# EAGLE design tester (EAGLE 9.6.2)
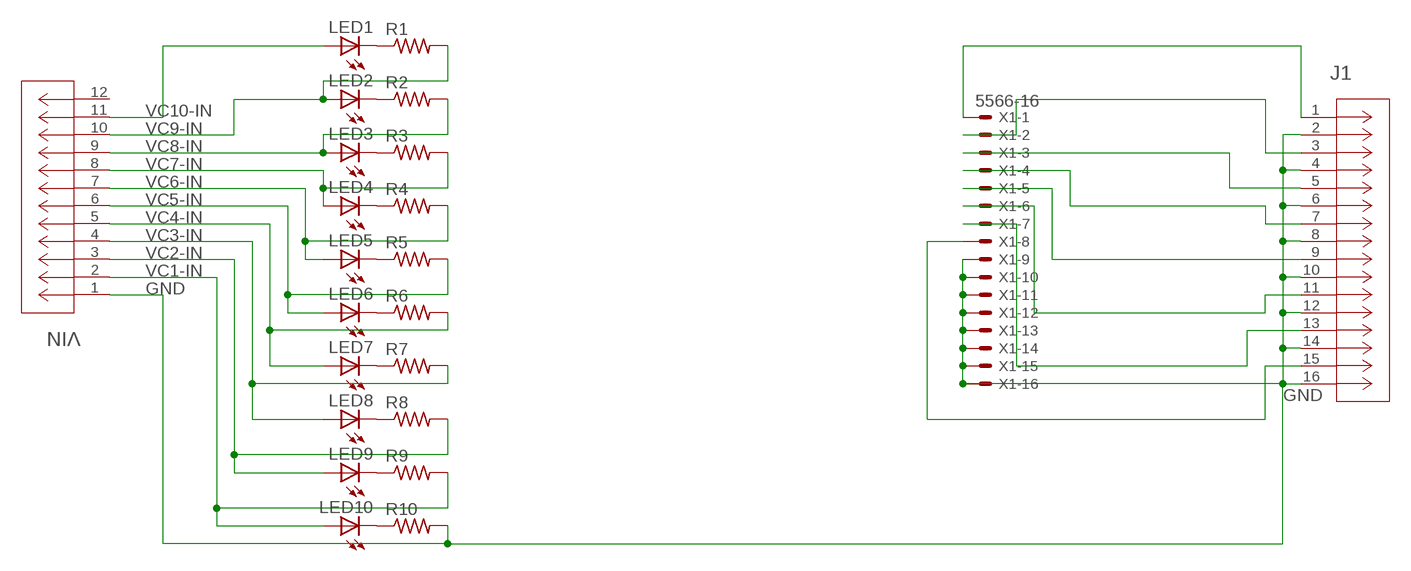
[diagram p0: schematic, sheet 1]

## Parts
J1  DF11-16DP-2DSA(01)  [CONN_DF11-16DP-2DSA(01)_HIR]
LED1  LEDCHIPLED_0603  [CHIPLED_0603]
LED2  LEDCHIPLED_0603  [CHIPLED_0603]
LED3  LEDCHIPLED_0603  [CHIPLED_0603]
LED4  LEDCHIPLED_0603  [CHIPLED_0603]
LED5  LEDCHIPLED_0603  [CHIPLED_0603]
LED6  LEDCHIPLED_0603  [CHIPLED_0603]
LED7  LEDCHIPLED_0603  [CHIPLED_0603]
LED8  LEDCHIPLED_0603  [CHIPLED_0603]
LED9  LEDCHIPLED_0603  [CHIPLED_0603]
LED10  LEDCHIPLED_0603  [CHIPLED_0603]
R1  R-US_R0805  [R0805]
R2  R-US_R0805  [R0805]
R3  R-US_R0805  [R0805]
R4  R-US_R0805  [R0805]
R5  R-US_R0805  [R0805]
R6  R-US_R0805  [R0805]
R7  R-US_R0805  [R0805]
R8  R-US_R0805  [R0805]
R9  R-US_R0805  [R0805]
R10  R-US_R0805  [R0805]
VIN  DF11-12DP-2DSA(01)  [CON12_2X6_UF_DF11_HIR]
X1  5566-16  [5566-16]

## Nets
GND: J1.2 J1.4 J1.6 J1.8 J1.10 J1.12 J1.14 J1.16 R10.2 VIN.1 X1.9 X1.10 X1.11 X1.12 X1.13 X1.14 X1.15 X1.16
N$1: LED2.C R2.1
N$2: LED3.C R3.1
N$3: LED5.C R5.1
N$4: LED6.C R6.1
N$5: LED7.C R7.1
N$6: LED8.C R8.1
N$7: LED9.C R9.1
N$8: LED10.C R10.1
N$9: LED1.C R1.1
N$10: LED4.C R4.1
TEMP1: J1.1 X1.1
TEMP2: J1.3 X1.2
TEMP3: J1.5 X1.3
TEMP4: J1.7 X1.4
TEMP5: J1.9 X1.5
TEMP6: J1.11 X1.6
TEMP7: J1.13 X1.7
TEMP8: J1.15 X1.8
VC1-IN: LED10.A R9.2 VIN.2
VC2-IN: LED9.A R8.2 VIN.3
VC3-IN: LED8.A R7.2 VIN.4
VC4-IN: LED7.A R6.2 VIN.5
VC5-IN: LED6.A R5.2 VIN.6
VC6-IN: LED5.A R4.2 VIN.7
VC7-IN: LED4.A R3.2 VIN.8
VC8-IN: LED3.A R2.2 VIN.9
VC9-IN: LED2.A R1.2 VIN.10
VC10-IN: LED1.A VIN.11
Unconnected: VIN.12

## Library data of the parts
J1 = hirose_connectors:DF11-16DP-2DSA(01); COPYRIGHT: Copyright (C) 2023 Ultra Librarian. All rights reserved.; MANUFACTURER_PART_NUMBER: DF11-16DP-2DSA(01); MFR_NAME: Hirose
LED1-LED10 = adafruit:LED: LED OSRAM: - CHIPLED LG R971, LG N971, LY N971, LG Q971, LY Q971, LO R971, LY R971 LH N974, LH R974 LS Q976, LO Q976, LY Q976 LO Q996 - Hyper CHIPLED LW Q18S LB Q993, LB Q99A, LB R99A - SideLED LS A670, LO A670, LY A670, LG A670, LP A670 LB A673, LV A673, LT A673, LW A673 LH A674 LY A675 LS A676, LA A676, LO A676, LY A676, LW A676 LS A679, LY A679, LG A679 - Hyper Micro SIDELED® LS Y876, LA Y876, LO Y876, LY Y876 LT Y87S - SmartLED LW L88C, LW L88S LB L89C, LB L89S, LG L890 LS L89K, LO L89K, LY L89K LS L896, LA L896, LO L896, LY L896 - TOPLED LS T670, LO T670, LY T670, LG T670, LP T670 LSG T670, LSP T670, LSY T670, LOP T670, LYG T670 LG T671, LOG T671, LSG T671 LB T673, LV T673, LT T673, LW T673 LH T674 LS T676, LA T676, LO T676, LY T676, LB T676, LH T676, LSB T676, LW T676 LB T67C, LV T67C, LT T67C, LS T67K, LO T67K, LY T67K, LW E67C LS E67B, LA E67B, LO E67B, LY E67B, LB E67C, LV E67C, LT E67C LW T67C LS T679, LY T679, LG T679 LS T770, LO T770, LY T770, LG T770, LP T770 LB T773, LV T773, LT T773, LW T773 LH T774 LS E675, LA E675, LY E675, LS T675 LS T776, LA T776, LO T776, LY T776, LB T776 LHGB T686 LT T68C, LB T68C - Hyper Mini TOPLED® LB M676 - Mini TOPLED Santana® LG M470 LS M47K, LO M47K, LY M47K Source: http://www.osram.convergy.de/
R1-R10 = rcl:R-US_: RESISTOR, American symbol; SPICEPREFIX: R
VIN = hirose_connectors:DF11-12DP-2DSA(01); COPYRIGHT: Copyright (C) 2023 Ultra Librarian. All rights reserved.; MANUFACTURER_PART_NUMBER: DF11-12DP-2DSA(01); MFR_NAME: Hirose
X1 = con-molex:5566-16: Mini FIT connector 16 pol Source: http://www.molex.com; MF: MOLEX; OC_FARNELL: unknown; OC_NEWARK: unknown

## Board
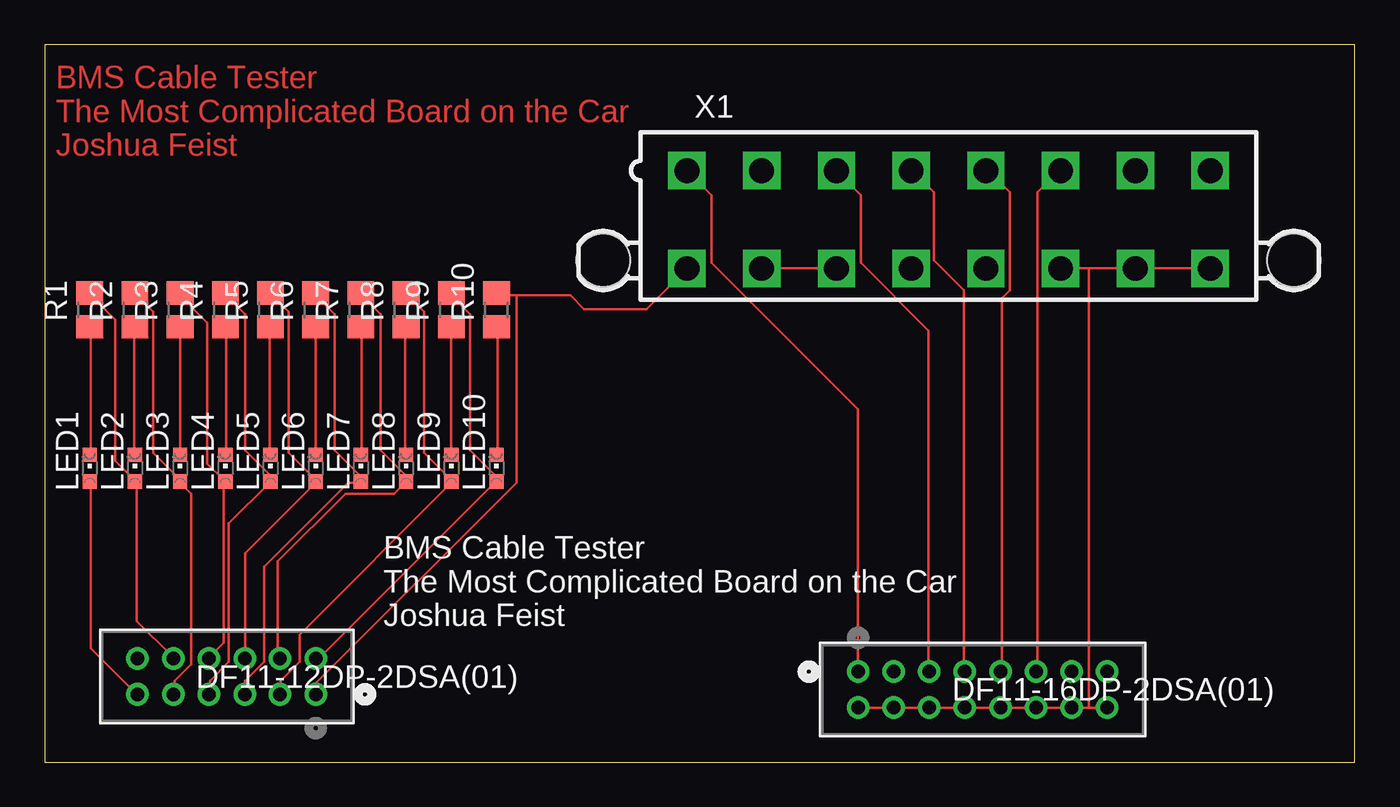
[diagram p1: board, top side]
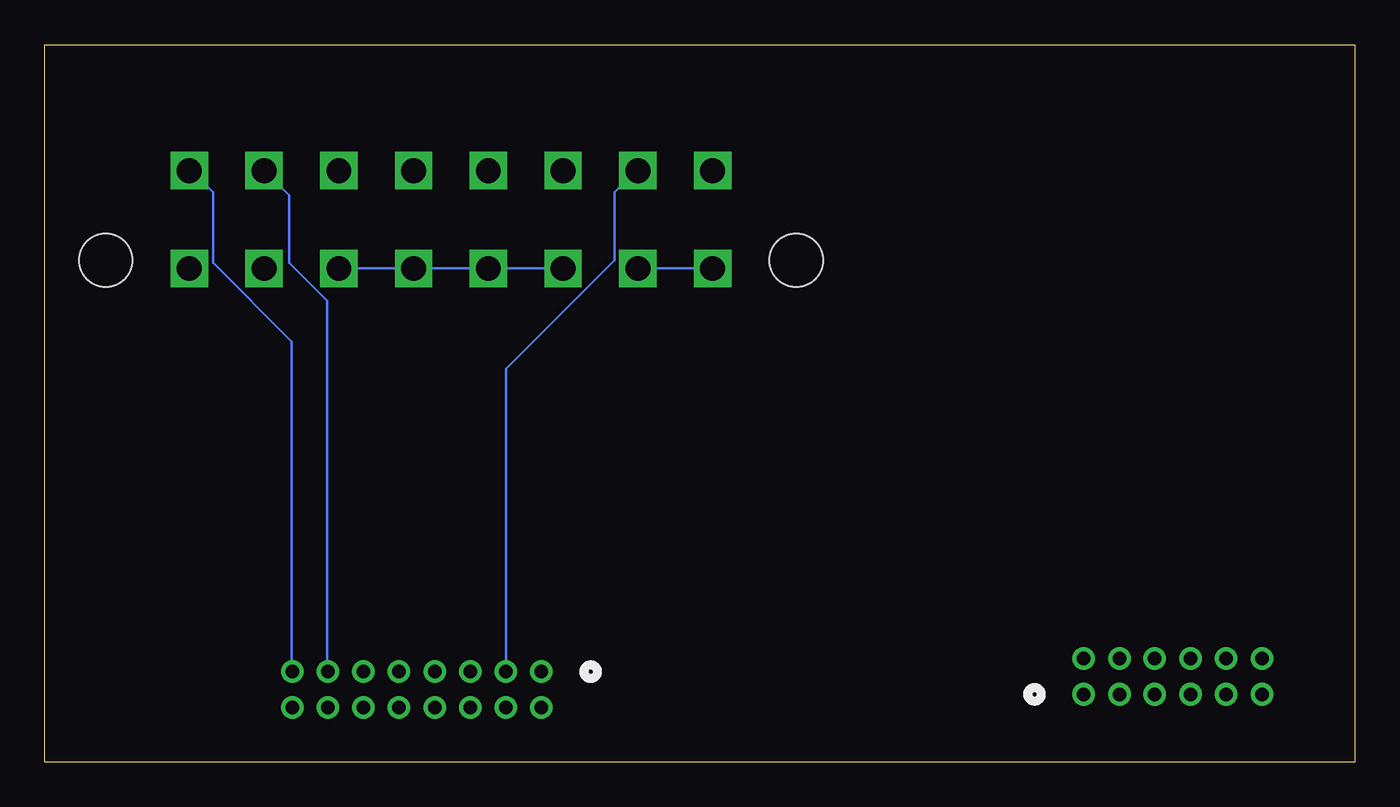
[diagram p2: board, bottom side, seen from below]

Size 73.64 x 40.31 mm. Coordinates in mm from the lower left corner, seen from the top.
Outline: 0,0 73.64,0 73.64,40.31 0,40.31 0,0
Copper layers (1*16): Top 0.035mm / dielectric 1.5mm / Bottom 0.035mm
Design rules "default": minimum track width 6mil, minimum drill 0.35mm, track to track 6mil, track to pad 6mil, pad to pad 6mil, via to via 6mil, smd to smd 6mil, copper to edge 40mil, drill to drill 6mil, minimum pad ring 10mil, minimum via ring 8mil, stop-mask expansion 4mil, vias tented up to drill 0mil, thermal gap 10mil

### Footprints (pad centres in the part's own frame; a part is rotated, then mirrored left to right if it is on the bottom)
CONN_DF11-16DP-2DSA(01)_HIR = drill 0.762 pad 1.27: 1 0,0; 2 0,-2.007; 3 2.007,0; 4 2.007,-2.007; 5 3.988,0; 6 3.988,-2.007; 7 5.994,0; 8 5.994,-2.007; 9 8.001,0; 10 8.001,-2.007; 11 10.008,0; 12 10.008,-2.007; 13 11.989,0; 14 11.989,-2.007; 15 13.995,0; 16 13.995,-2.007
CHIPLED_0603 = smd 0.8 x 0.8: A 0,-0.75; C 0,0.75
R0805 = smd 1.3 x 1.5: 1 -0.95,0; 2 0.95,0
CON12_2X6_UF_DF11_HIR = drill 0.762 pad 1.27: 1 0,0; 2 0,2.007; 3 -2.007,0; 4 -2.007,2.007; 5 -3.988,0; 6 -3.988,2.007; 7 -5.994,0; 8 -5.994,2.007; 9 -8.001,0; 10 -8.001,2.007; 11 -10.008,0; 12 -10.008,2.007
5566-16 = drill 1.4 square: 1 14.7,-2.75; 2 10.5,-2.75; 3 6.3,-2.75; 4 2.1,-2.75; 5 -2.1,-2.75; 6 -6.3,-2.75; 7 -10.5,-2.75; 8 -14.7,-2.75; 9 14.7,2.75; 10 10.5,2.75; 11 6.3,2.75; 12 2.1,2.75; 13 -2.1,2.75; 14 -6.3,2.75; 15 -10.5,2.75; 16 -14.7,2.75 | hole 3: 19.4,2.29; -19.4,2.29

### Placement (x,y rotation side)
J1  45.72,5.08 0 top
LED1  2.54,16.51 0 top
LED2  5.08,16.51 0 top
LED3  7.62,16.51 0 top
LED4  10.16,16.51 0 top
LED5  12.7,16.51 0 top
LED6  15.24,16.51 0 top
LED7  17.78,16.51 0 top
LED8  20.32,16.51 0 top
LED9  22.86,16.51 0 top
LED10  25.4,16.51 0 top
R1  2.54,25.4 90 top
R2  5.08,25.4 90 top
R3  7.62,25.4 90 top
R4  10.16,25.4 90 top
R5  12.7,25.4 90 top
R6  15.24,25.4 90 top
R7  17.78,25.4 90 top
R8  20.32,25.4 90 top
R9  22.86,25.4 90 top
R10  25.4,25.4 90 top
VIN  15.24,3.81 0 top
X1  50.8,30.48 180 top

### Tracks (layer width: path | path; a pad name or v marks a point on that pad's centre or on a via)
GND
  Top 0.152: 58.67,3.05 59.59,3.05 J1.16 | 58.67,3.05 57.76,3.05 J1.14 57.61,3.05 55.78,3.05 J1.12 55.63,3.05 53.8,3.05 J1.10 53.65,3.05 51.82,3.05 J1.8 51.66,3.05 49.84,3.05 J1.6 49.68,3.05 47.85,3.05 J1.4 47.7,3.05 45.72,3.05 J1.2 | X1.16 65.38,27.74 61.42,27.74 X1.15 61.27,27.74 58.67,27.74 | 58.67,27.74 57.15,27.74 X1.14 | 58.67,27.74 58.67,3.05 | X1.10 40.39,27.74 44.35,27.74 X1.11 | 26.52,26.21 29.57,26.21 30.33,25.45 33.83,25.45 35.97,27.58 X1.9 | 26.52,26.21 25.45,26.21 R10.2 | VIN.1 15.24,4.42 26.52,15.7 26.52,26.21
  Bottom 0.152: X1.14 57,27.74 53.03,27.74 X1.13 52.88,27.74 48.77,27.74 X1.12 48.62,27.74 X1.11 | X1.10 40.23,27.74 36.12,27.74 X1.9
N$1
  Top 0.152: LED2.C 5.03,17.37 5.03,24.38 R2.1
N$2
  Top 0.152: R3.1 LED3.C
N$3
  Top 0.152: LED5.C 12.65,17.37 12.65,24.38 R5.1
N$4
  Top 0.152: R6.1 LED6.C
N$5
  Top 0.152: LED7.C 17.83,17.37 17.83,24.38 R7.1
N$6
  Top 0.152: LED8.C 20.27,17.37 20.27,24.38 R8.1
N$7
  Top 0.152: R9.1 LED9.C
N$8
  Top 0.152: LED10.C 25.45,17.37 25.45,24.38 R10.1
N$9
  Top 0.152: LED1.C 2.59,17.37 2.59,24.38 R1.1
N$10
  Top 0.152: LED4.C 10.21,17.37 10.21,24.38 R4.1
TEMP1
  Top 0.152: J1.1 45.72,19.81 37.49,28.04 37.49,31.85 36.12,33.22 X1.1
TEMP2
  Bottom 0.152: J1.3 47.7,5.18 47.7,22.1 41.6,28.19 41.6,32 40.39,33.22 X1.2
TEMP3
  Top 0.152: J1.5 49.68,5.18 49.68,24.23 45.87,28.04 45.87,31.85 X1.3
TEMP4
  Top 0.152: J1.7 51.66,5.18 51.66,26.52 49.99,28.19 49.99,32 48.77,33.22 X1.4
TEMP5
  Top 0.152: J1.9 53.8,5.18 53.8,26.06 54.25,26.52 54.25,32 53.03,33.22 X1.5
TEMP6
  Top 0.152: J1.11 55.78,5.18 55.78,32 57,33.22 X1.6
TEMP7
  Bottom 0.152: J1.13 57.76,5.18 57.76,25.91 59.89,28.04 59.89,31.85 61.27,33.22 X1.7
TEMP8
  Bottom 0.152: J1.15 59.74,5.18 59.74,23.62 64.16,28.04 64.16,32 65.38,33.22 X1.8
VC1-IN
  Top 0.152: R9.2 22.86,26.21 23.93,25.15 23.93,17.53 25.3,16.15 25.3,15.85 LED10.A 25.3,15.7 15.54,5.94 15.24,5.94 VIN.2
VC2-IN
  Top 0.152: R8.2 20.42,26.21 21.34,25.3 21.34,17.37 22.86,15.85 LED9.A 22.86,15.7 14.33,7.16 14.33,5.64 13.26,4.57 13.26,3.81 VIN.3
VC3-IN
  Top 0.152: R7.2 17.83,26.21 18.9,25.15 18.9,17.53 20.27,16.15 20.27,15.85 LED8.A 20.27,15.7 19.66,15.09 16.92,15.09 13.11,11.28 13.11,5.94 VIN.4
VC4-IN
  Top 0.152: R6.2 15.24,26.21 16.31,25.15 16.31,17.53 17.68,16.15 17.68,15.85 LED7.A 17.68,15.7 17.07,15.7 12.34,10.97 12.34,5.64 11.28,4.57 11.28,3.81 VIN.5
VC5-IN
  Top 0.152: R5.2 12.8,26.21 13.72,25.3 13.72,17.37 15.24,15.85 LED6.A 15.24,15.7 11.28,11.73 11.28,5.94 VIN.6
VC6-IN
  Top 0.152: R4.2 10.21,26.21 11.28,25.15 11.28,17.53 12.65,16.15 12.65,15.85 LED5.A 12.65,15.7 10.36,13.41 10.36,5.64 9.3,4.57 9.3,3.81 VIN.7
VC7-IN
  Top 0.152: VIN.8 9.3,5.94 10.06,6.71 10.06,15.7 LED4.A 10.06,15.85 9.14,16.76 9.14,24.69 7.62,26.21 R3.2
VC8-IN
  Top 0.152: R2.2 5.18,26.21 6.1,25.3 6.1,17.37 7.62,15.85 LED3.A 7.62,15.7 8.23,15.09 8.23,5.49 7.32,4.57 7.32,3.81 VIN.9
VC9-IN
  Top 0.152: VIN.10 7.16,5.94 5.18,7.92 5.18,15.7 LED2.A 5.03,15.85 3.96,16.92 3.96,24.84 2.59,26.21 R1.2
VC10-IN
  Top 0.152: LED1.A 2.59,15.7 2.59,6.4 5.18,3.81 VIN.11

### Text on the board
Top: BMS Cable Tester / The Most Complicated Board on the Car / Joshua Feist
tPlace: BMS Cable Tester / The Most Complicated Board on the Car / Joshua Feist